# Altium schematic sheet STM32F411CEU6模块.SchDoc
size A4
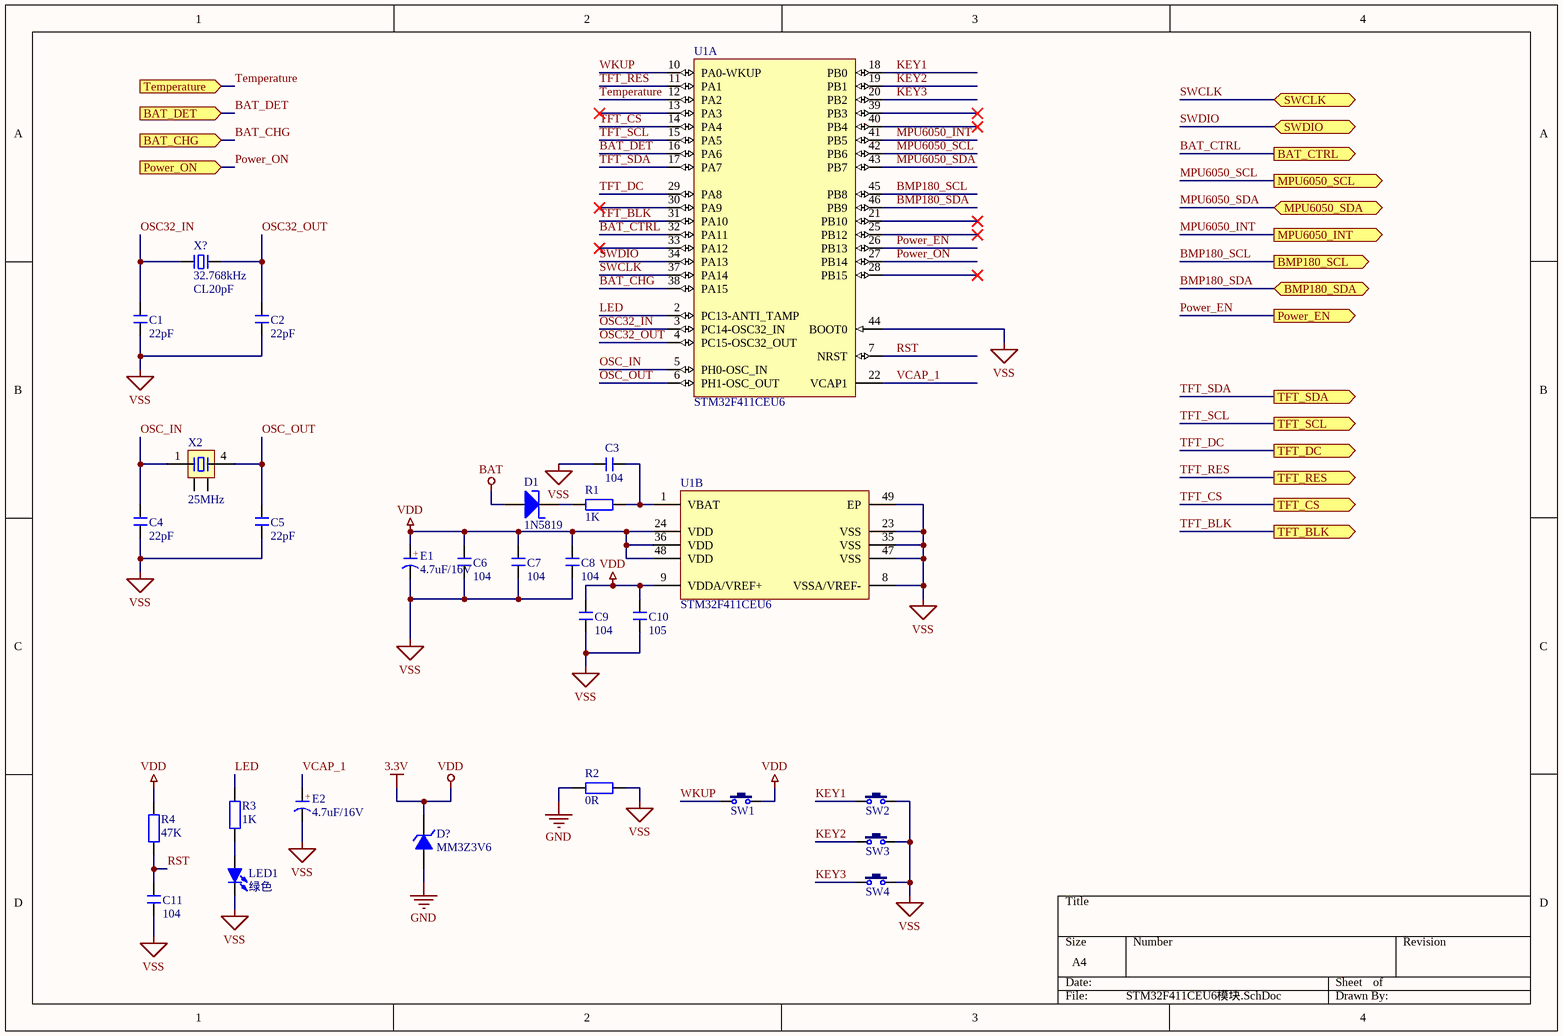
[diagram p0: STM32F411CEU6模块.SchDoc]

## Parts
C1  22pF  [C 0402_M]
C2  22pF  [C 0402_M]
C3  104  [C 0603_L]
C4  22pF  [C 0402_M]
C5  22pF  [C 0402_M]
C6  104  [C 0603_L]
C7  104  [C 0603_L]
C8  104  [C 0603_L]
C9  104  [C 0603_L]
C10  105  [C 0402_M]
C11  104  [C 0603_L]
D1  1N5819  [SOD-323]
D?  MM3Z3V6  [SOD-323]
E1  4.7uF/16V  [CD A(3216)]
E2  4.7uF/16V  [CD A(3216)]
LED1  绿色  [LED 0603G]
R1  1K  [R 0603_L]
R2  0R  [R 0603_L]
R3  1K  [R 0603_L]
R4  47K  [R 0603_L]
SW1  3x6x5  [TSW 3*6*4.3-S-W]  (value not drawn)
SW2  3x6x5  [TSW 3*6*4.3-S-W]  (value not drawn)
SW3  3x6x5  [TSW 3*6*4.3-S-W]  (value not drawn)
SW4  3x6x5  [TSW 3*6*4.3-S-W]  (value not drawn)
U1  STM32F411CEU6  [QFN48 7X7_N]  (parts A,B of 2)
X2  25MHz  [OSC 1612-4P]
X?  32.768kHz  负载电容: CL20pF  [OSC 1016-2P]

## Ports
BAT_CHG (in), BAT_CTRL (out), BAT_DET (in), BMP180_SCL (out), BMP180_SDA (bidir), MPU6050_INT (out), MPU6050_SCL (out), MPU6050_SDA (bidir), Power_EN (out), Power_ON (in), SWCLK (bidir), SWDIO (bidir), Temperature (in), TFT_BLK (out), TFT_CS (out), TFT_DC (out), TFT_RES (out), TFT_SCL (out), TFT_SDA (out)

## Nets
3.3V: C6.2 C7.2 C8.2 C9.2 C10.2 D?.2(K) E1.1(A) R4.2 SW1.2 U1.9(VDDA/VREF+) U1.24(VDD) U1.36(VDD) U1.48(VDD)  [also labelled VDD]
BAT: D1.1(A)
GND: D?.1(A) R2.2
VSS: C1.1 C2.1 C3.2 C4.1 C5.1 C6.1 C7.1 C8.1 C9.1 C10.1 C11.1 E1.2(K) E2.2(K) LED1.2(K) R2.1 SW2.2 SW3.2 SW4.2 U1.8(VSSA/VREF-) U1.23(VSS) U1.35(VSS) U1.44(BOOT0) U1.47(VSS) U1.49(EP)
BAT_CHG: U1.38(PA15) ; port BAT_CHG
BAT_CTRL: U1.32(PA11) ; port BAT_CTRL
BAT_DET: U1.16(PA6) ; port BAT_DET
BMP180_SCL: U1.45(PB8) ; port BMP180_SCL
BMP180_SDA: U1.46(PB9) ; port BMP180_SDA
KEY1: SW2.1 U1.18(PB0)
KEY2: SW3.1 U1.19(PB1)
KEY3: SW4.1 U1.20(PB2)
LED: R3.2 U1.2(PC13-ANTI_TAMP)
MPU6050_INT: U1.41(PB5) ; port MPU6050_INT
MPU6050_SCL: U1.42(PB6) ; port MPU6050_SCL
MPU6050_SDA: U1.43(PB7) ; port MPU6050_SDA
OSC32_IN: C1.2 U1.3(PC14-OSC32_IN) X?.1
OSC32_OUT: C2.2 U1.4(PC15-OSC32_OUT) X?.2
OSC_IN: C4.2 U1.5(PH0-OSC_IN) X2.1
OSC_OUT: C5.2 U1.6(PH1-OSC_OUT) X2.4
Power_EN: U1.26(PB13) ; port Power_EN
Power_ON: U1.27(PB14) ; port Power_ON
RST: C11.2 R4.1 U1.7(NRST)
SWCLK: U1.37(PA14) ; port SWCLK
SWDIO: U1.34(PA13) ; port SWDIO
Temperature: U1.12(PA2) ; port Temperature
TFT_BLK: U1.31(PA10) ; port TFT_BLK
TFT_CS: U1.14(PA4) ; port TFT_CS
TFT_DC: U1.29(PA8) ; port TFT_DC
TFT_RES: U1.11(PA1) ; port TFT_RES
TFT_SCL: U1.15(PA5) ; port TFT_SCL
TFT_SDA: U1.17(PA7) ; port TFT_SDA
VCAP_1: E2.1(A) U1.22(VCAP1)
WKUP: SW1.1 U1.10(PA0-WKUP)
NetC3_1: C3.1 R1.2 U1.1(VBAT)
NetD1_2: D1.2(K) R1.1
NetLED1_1: LED1.1(A) R3.1

Not connected (* = marked no-connect by the designer): U1 13(PA3)* 21(PB10)* 25(PB12)* 28(PB15)* 30(PA9)* 33(PA12)* 39(PB3)* 40(PB4)*; X2 2 3

## Notes on the sheet
- (in symbol C-CD) +

## Library data of the parts
C1-C11 = C: 无极性贴片电容; 版权归属: 黎明电子style; BOM名称: 无极性贴片电容; 学习资源: https://lmdzstyle.taobao.com/
D1 = 1N5819: 肖特基二极管; 版权归属: 源创客; 属性: 40V/2A; BOM名称: 肖特基二极管; 学习资源: www.ooocke.com
D? = MM3Z3V6: 3.6V/0.3W稳压管
E1 E2 = C-CD: 贴片钽电容; 版权归属: 黎明电子style; BOM名称: 贴片钽电容; 学习资源: https://lmdzstyle.taobao.com/
LED1 = LED-SMD: 贴片LED; 版权归属: 源创客; BOM名称: 贴片LED; 学习资源: www.ooocke.com
R1-R4 = R: 贴片电阻; 版权归属: 黎明电子style; BOM名称: 贴片电阻; 学习资源: https://lmdzstyle.taobao.com/
SW1-SW4 = TSW 3x6: 3x6轻触开关; 版权归属: 源创客; BOM名称: 3x6轻触开关; 学习资源: www.ooocke.com
U1 = STM32F411CEU6: ARM Cortex-M4 32-bit MCU+FPU, 105 DMIPS, 256 kB Flash, 64 kB Internal RAM, 36 I/Os, 48-pin UFQFPN, -40 to 85 degC, Tray; Manufacturer: STMicroelectronics; PartNumber: STM32F401CCU6; FLASH Size (Prog) (kB): 256; I/Os (High Current): 36; Internal RAM Size (kB): 64; Operating Frequency(F) (Processor speed) (MHz): 84; Supply Voltage(Vcc) max (V): 3.6; Supply Voltage(Vcc) min (V): 1.8; DatasheetVersion: Rev. 1; PackageVersion: Rev. 1, 04/2013; PackageReference: UFQFPN48; PackageDescription: 48-Pin Ultra Thin Fine Pitch Quad Flat No-Lead, 7 x 7 x 0.6 mm Body, 0.5 mm Pitch, Exposed Pad; Supplier 1: Newark; Supplier Part Number 1: 19X6217; Supplier 2: Mouser; Supplier Part Number 2: 511-STM32F401CCU6; Core: ARM Cortex-M4; Packing: Tray; Mounting Technology: Surface Mount; ComponentLink1Description: Manufacturer URL; ComponentLink1URL: http://www.st.com/web/en/home.html; ComponentLink2Description: Datasheet; ComponentLink2URL: http://www.st.com/st-web-ui/static/active/en/resource/technical/document/data_brief/DM00071938.pdf; ComponentLink3Description: Package Specification; ComponentLink3URL: http://www.st.com/st-web-ui/static/active/en/resource/technical/document/data_brief/DM00071938.pdf
X2 = XTAL-MC-4P: MC系列4脚晶振; BOM名称: 2脚无源脚晶振; 版权归属: 源创客; 学习资源: www.ooocke.com
X? = XTAL-2P: 2脚无源脚晶振; 版权归属: 源创客; BOM名称: 2脚无源脚晶振; 学习资源: www.ooocke.com